# Altium project Biricutico.PrjPCB (part 2 of 2)

## Sheet C_M.SchDoc
size A4
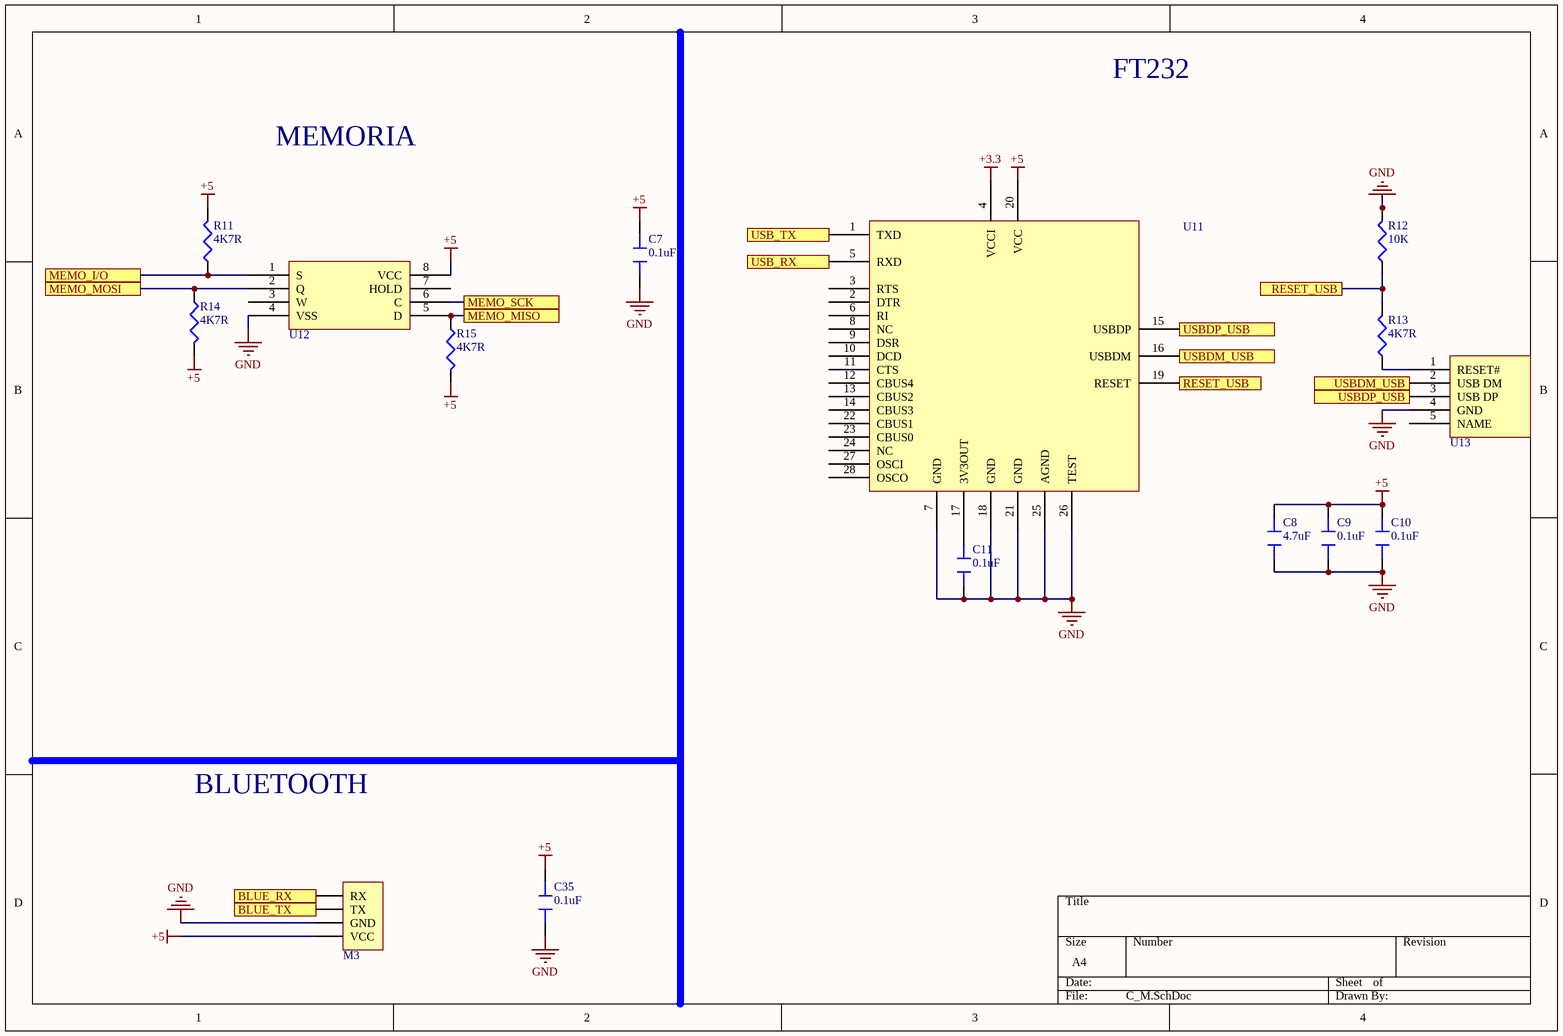
[diagram p5: C_M.SchDoc]

### Parts
C7  0.1uF  [CAPACITOR 0805]
C8  4.7uF  [CAPACITOR 0805]
C9  0.1uF  [CAPACITOR 0805]
C10  0.1uF  [CAPACITOR 0805]
C11  0.1uF  [CAPACITOR 0805]
C35  0.1uF  [CAPACITOR 0805]
M3  Headers (1x4)_BLUE  [HDR1X4]  (value not drawn)
R11  4K7R  [6-0805_M]
R12  10K  [6-0805_M]
R13  4K7R  [6-0805_M]
R14  4K7R  [6-0805_M]
R15  4K7R  [6-0805_M]
U11  USB Interface  [SOP65P780X200-28N]  (value not drawn)
U12  EEPROM 256Kbit  [M95256-DRMN8TP/K]  (value not drawn)
U13  USB Connectors  [USB Micro]  (value not drawn)

### Ports
BLUE_RX, BLUE_TX, MEMO_I/O, MEMO_MISO, MEMO_MOSI, MEMO_SCK, RESET_USB, USB_RX, USB_TX, USBDM_USB, USBDP_USB

### Nets
+3.3: U11.4(VCCI)
+5: C7.2 C8.2 C9.2 C10.2 C35.2 M3.4(VCC) R11.2 R14.2 R15.2 U11.20(VCC) U12.8(VCC)
GND: C7.1 C8.1 C9.1 C10.1 C11.1 C35.1 M3.3(GND) R12.2 U11.7(GND) U11.18(GND) U11.21(GND) U11.25(AGND) U11.26(TEST) U12.4(VSS) U13.4(GND)
BLUE_RX: M3.1(RX) ; port BLUE_RX
BLUE_TX: M3.2(TX) ; port BLUE_TX
MEMO_I/O: R11.1 U12.1(S) ; port MEMO_I/O
MEMO_MISO: R15.1 U12.5(D) ; port MEMO_MISO
MEMO_MOSI: R14.1 U12.2(Q) ; port MEMO_MOSI
MEMO_SCK: U12.6(C) ; port MEMO_SCK
RESET_USB: R12.1 R13.2 U11.19(RESET) ; port RESET_USB
USB_RX: U11.5(RXD) ; port USB_RX
USB_TX: U11.1(TXD) ; port USB_TX
USBDM_USB: U11.16(USBDM) U13.2(USB_DM) ; port USBDM_USB
USBDP_USB: U11.15(USBDP) U13.3(USB_DP) ; port USBDP_USB
NetC11_2: C11.2 U11.17(3V3OUT)
NetR13_1: R13.1 U13.1(RESET#)

Not connected (* = marked no-connect by the designer): U11 2(DTR) 3(RTS) 6(RI) 8(NC) 9(DSR) 10(DCD) 11(CTS) 12(CBUS4) 13(CBUS2) 14(CBUS3) 22(CBUS1) 23(CBUS0) 24(NC) 27(OSCI) 28(OSCO); U12 3(W) 7(HOLD); U13 5(NAME)

### Notes on the sheet
- FT232
- MEMORIA
- BLUETOOTH

### Library data of the parts
C7 C9-C11 C35 = Capacitor  0.1uF 0805: Multilayer Ceramic Capacitors MLCC - SMD/SMT .1uF 50volts 10%; Manufacturer: Vishay Vitramon; Manufacturer Part Number: VJ0805Y104KXAAT; Capacitance: 100nF; Voltage Rating: 50V; Dielectric: X7R; Supplier 1: Mouser; Stock 1: 207342; Pricing 1: 1=0.2, 10=0.2, 50=0.162, 100=0.108, 500=0.095, 1000=0.084, 3000=0.072, 6000=0.069, 9000=0.065, 10000=0.065 (USD); Mount: Surface Mount; Case/Package: 0805; Weight: 0.000194oz; Case Code (Metric): 2012; Case Code (Imperial): 0805; Min Operating Temperature: -55°C; Max Operating Temperature: 125°C; Tolerance: 10%; Package Quantity: 1; Packaging: Tape and Reel; Voltage Rating (DC): 50V; Termination: SMD/SMT; Voltage: 50V; Length: 2mm; Height: 1.45mm; Width: 0.049inch; Thickness: 0.057inch; Depth: 1.25mm; Radiation Hardening: No; REACH SVHC: Unknown; Lead Free: Lead Free; ComponentLink1URL: http://www.mouser.com/ds/2/427/vjcommercialseries-222796.pdf?src-supplier=Mouser; ComponentLink1Description: http://www.mouser.com/ds/2/427/vjcommercialseries-222796.pdf?src-supplier=Mouser; ComponentLink2URL: http://www.vishay.com/docs/45199/vjcommercialseries.pdf?src-supplier=Digi-Key; ComponentLink2Description: http://www.vishay.com/docs/45199/vjcommercialseries.pdf?src-supplier=Digi-Key; ComponentLink3URL: http://www.vishay.com/docs/45199/vjcommercialseries.pdf?src-supplier=Future+Electronics; ComponentLink3Description: http://www.vishay.com/docs/45199/vjcommercialseries.pdf?src-supplier=Future+Electronics; Supplier Part Number 1: 77-VJ0805Y104KXAAT; Category: Multilayer Ceramic Capacitors MLCC - SMD/SMT
C8 = Capacitor 4.7uF 0805: MURATA - GRM21BR61H475KE51L - CAP, 4.7µF, 50V, 10%, X5R, 0805; Material: Ceramic; Supplier 1: Mouser; Manufacturer: Murata; Manufacturer Part Number: GRM21BR61H475KE51L; Stock 1: 243744; Pricing 1: 1=0.37, 10=0.256, 50=0.256, 100=0.153, 500=0.115, 1000=0.097, 3000=0.08, 6000=0.075, 9000=0.071, 10000=0.071 (USD); Mount: Surface Mount; Case/Package: 0805; Case Code (Metric): 2012; Case Code (Imperial): 0805; Min Operating Temperature: -55°C; Max Operating Temperature: 85°C; Capacitance: 4.7uF; Tolerance: 10%; Packaging: Tape and Reel; Dielectric: X5R; Voltage Rating: 50V; Voltage Rating (DC): 50V; Length: 2mm; Height: 1.25mm; Width: 0.049inch; Thickness: 0.055inch; Depth: 1.25mm; REACH SVHC: No SVHC; Lead Free: Lead Free; ComponentLink1URL: http://components.arrow.com/part/dataview/61084395S454511N2606?src-supplier=Arrow; ComponentLink1Description: http://components.arrow.com/part/dataview/61084395S454511N2606?src-supplier=Arrow; ComponentLink2URL: http://components.arrow.com/part/dataview/0323_07281654?src-supplier=Arrow+Europe; ComponentLink2Description: http://components.arrow.com/part/dataview/0323_07281654?src-supplier=Arrow+Europe; ComponentLink3URL: https://search.murata.co.jp/Ceramy/image/img/A01X/G101/ENG/GRM21BR61H475KE51-01.pdf?src-supplier=Digi-Key; ComponentLink3Description: https://search.murata.co.jp/Ceramy/image/img/A01X/G101/ENG/GRM21BR61H475KE51-01.pdf?src-supplier=Digi-Key; ComponentLink4URL: http://search.murata.co.jp/Ceramy/image/img/A01X/G101/ENG/GRM21BR61H475KE51-01.pdf?src-supplier=Digi-Key; ComponentLink4Description: http://search.murata.co.jp/Ceramy/image/img/A01X/G101/ENG/GRM21BR61H475KE51-01.pdf?src-supplier=Digi-Key; ComponentLink5URL: http://www.farnell.com/datasheets/2079186.pdf?src-supplier=Farnell; ComponentLink5Description: http://www.farnell.com/datasheets/2079186.pdf?src-supplier=Farnell; ComponentLink6URL: http://www.farnell.com/datasheets/2079186.pdf?src-supplier=Element14; ComponentLink6Description: http://www.farnell.com/datasheets/2079186.pdf?src-supplier=Element14; ComponentLink7URL: http://www.farnell.com/datasheets/2079186.pdf?src-supplier=Newark; ComponentLink7Description: http://www.farnell.com/datasheets/2079186.pdf?src-supplier=Newark; Supplier Part Number 1: 81-GRM21BR61H475KE1L; Category: Multilayer Ceramic Capacitors MLCC - SMD/SMT
M3 = Headers (1x4)_BLUE: Header, 4-Pin; LatestRevisionDate: 17-Jul-2002; LatestRevisionNote: Re-released for DXP Platform.; Publisher: Altium Limited
R11 R13-R15 = Resistor 4.7K 0805: RES SMD 4.7K OHM 1% 1/8W 0805; Manufacturer: Vishay; Manufacturer Part Number: CRCW08054K70FKEA; Resistance: 4.7kR; Power Rating: 125mW; Voltage Rating: 150V; Temperature Coefficient: 100ppm/°C; Supplier 1: Mouser; Stock 1: 49115; Pricing 1: 1=0.1, 10=0.066, 50=0.066, 100=0.047, 1000=0.027, 10000=0.015 (USD); Case/Package: 0805; Weight: 0.000194oz; Case Code (Imperial): 0805; Case Code (Metric): 2012; Contact Plating: Tin; Min Operating Temperature: -55°C; Max Operating Temperature: 155°C; Tolerance: 1%; Packaging: Tape and Reel; Package Quantity: 10; Composition: Thick Film; Number of Terminations: 2; Termination: SMD/SMT; Military Standard: Not; Max Power Dissipation: 125mW; Voltage Rating (DC): 150V; Features: Automotive AEC-Q200; Length: 2mm; Height: 0.45mm; Width: 1.25mm; Depth: 1.25mm; Radiation Hardening: No; REACH SVHC: Unknown; Lead Free: Lead Free; ComponentLink1URL: http://uk.rs-online.com/webdocs/0d98/0900766b80d98b26.pdf?src-supplier=RSComponents; ComponentLink1Description: http://uk.rs-online.com/webdocs/0d98/0900766b80d98b26.pdf?src-supplier=RSComponents; ComponentLink2URL: http://www.vishay.com/docs/20035/dcrcwe3.pdf?src-supplier=Future+Electronics; ComponentLink2Description: http://www.vishay.com/docs/20035/dcrcwe3.pdf?src-supplier=Future+Electronics; ComponentLink3URL: http://www.alliedelec.com/m/d/0c934d6939ccefa68dbe0b96d821c8cf.pdf?src-supplier=Allied+Electronics; ComponentLink3Description: http://www.alliedelec.com/m/d/0c934d6939ccefa68dbe0b96d821c8cf.pdf?src-supplier=Allied+Electronics; ComponentLink4URL: http://www.mouser.com/ds/2/427/dcrcwe3-109170.pdf?src-supplier=Mouser; ComponentLink4Description: http://www.mouser.com/ds/2/427/dcrcwe3-109170.pdf?src-supplier=Mouser; ComponentLink5URL: https://www.distrelec.biz/Web/Downloads/a_/en/flD-CRCW-e3_data_en.pdf?mime=application%2Fpdf&src-supplier=Distrelec; ComponentLink5Description: https://www.distrelec.biz/Web/Downloads/a_/en/flD-CRCW-e3_data_en.pdf?mime=application%2Fpdf&src-supplier=Distrelec; ComponentLink6URL: http://www.vishay.com/docs/20035/dcrcwe3.pdf?src-supplier=Avnet; ComponentLink6Description: http://www.vishay.com/docs/20035/dcrcwe3.pdf?src-supplier=Avnet; ComponentLink7URL: http://www.vishay.com/docs/20035/dcrcwe3.pdf?src-supplier=Digi-Key; ComponentLink7Description: http://www.vishay.com/docs/20035/dcrcwe3.pdf?src-supplier=Digi-Key; Supplier Part Number 1: 71-CRCW0805-4.7K-E3; Category: Thick Film Resistors - SMD
R12 = Resistor 10k 0805: RES SMD 10K OHM 1% 1/8W 0805; Manufacturer: Vishay; Manufacturer Part Number: CRCW080510K0FKEA; Resistance: 10kR; Power Rating: 125mW; Voltage Rating: 150V; Temperature Coefficient: 100ppm/°C; Supplier 1: Mouser; Stock 1: 474662; Pricing 1: 1=0.1, 10=0.066, 50=0.066, 100=0.06, 1000=0.043, 10000=0.019 (USD); Case/Package: 0805; Weight: 0.000194oz; Case Code (Imperial): 0805; Case Code (Metric): 2012; Contact Plating: Tin; Min Operating Temperature: -55°C; Max Operating Temperature: 155°C; Tolerance: 1%; Packaging: Tape and Reel; Package Quantity: 5000; Composition: Thick Film; Military Standard: Not; Termination: SMD/SMT; Voltage Rating (DC): 150V; Length: 2mm; Height: 0.45mm; Width: 1.25mm; Depth: 1.25mm; Radiation Hardening: No; REACH SVHC: Unknown; Lead Free: Lead Free; ComponentLink1URL: http://www.mouser.com/ds/2/427/dcrcwe3-109170.pdf?src-supplier=Mouser; ComponentLink1Description: http://www.mouser.com/ds/2/427/dcrcwe3-109170.pdf?src-supplier=Mouser; ComponentLink2URL: http://uk.rs-online.com/webdocs/0d98/0900766b80d98b26.pdf?src-supplier=RSComponents; ComponentLink2Description: http://uk.rs-online.com/webdocs/0d98/0900766b80d98b26.pdf?src-supplier=RSComponents; ComponentLink3URL: http://www.alliedelec.com/m/d/0c934d6939ccefa68dbe0b96d821c8cf.pdf?src-supplier=Allied+Electronics; ComponentLink3Description: http://www.alliedelec.com/m/d/0c934d6939ccefa68dbe0b96d821c8cf.pdf?src-supplier=Allied+Electronics; ComponentLink4URL: http://www.vishay.com/docs/20035/dcrcwe3.pdf?src-supplier=Avnet+Asia; ComponentLink4Description: http://www.vishay.com/docs/20035/dcrcwe3.pdf?src-supplier=Avnet+Asia; ComponentLink5URL: http://www.vishay.com/docs/20035/dcrcwe3.pdf?src-supplier=Avnet+Europe; ComponentLink5Description: http://www.vishay.com/docs/20035/dcrcwe3.pdf?src-supplier=Avnet+Europe; ComponentLink6URL: http://www.vishay.com/docs/20035/dcrcwe3.pdf?src-supplier=Avnet; ComponentLink6Description: http://www.vishay.com/docs/20035/dcrcwe3.pdf?src-supplier=Avnet; ComponentLink7URL: http://www.farnell.com/datasheets/2310790.pdf?src-supplier=Element14; ComponentLink7Description: http://www.farnell.com/datasheets/2310790.pdf?src-supplier=Element14; ComponentLink8URL: http://www.vishay.com/docs/20035/dcrcwe3.pdf?src-supplier=Future+Electronics; ComponentLink8Description: http://www.vishay.com/docs/20035/dcrcwe3.pdf?src-supplier=Future+Electronics; Supplier Part Number 1: 71-CRCW0805-10K-E3; Category: Thick Film Resistors - SMD
U11 = USB Interface: IC USB FS SERIAL UART 28-SSOP; Manufacturer: FTDI; Manufacturer Part Number: FT232RL-REEL; Number of Channels: 1; Max Supply Voltage: 5.25V; Min Supply Voltage: 3.3V; Data Rate: 12Mbps; Interface: UART,RS-232,RS-422,RS-485; Operating Supply Current: 15mA; Voltage: 5V; Supplier 1: Mouser; Stock 1: 115709; Pricing 1: 1=4.5, 10=4.05, 50=3.85, 100=3.65, 250=3.25, 500=2.85, 1000=2.65, 6000=2.35, 10000=2.65 (USD); Mount: Surface Mount; Case/Package: SSOP; Number of Pins: 28; Weight: 0.080001oz; Min Operating Temperature: -40°C; Max Operating Temperature: 85°C; Packaging: Tape and Reel; Package Quantity: 2000; Number of Transceivers: 1; Length: 10.2mm; Height: 1.75mm; Width: 5.3mm; Radiation Hardening: No; REACH SVHC: No SVHC; Lead Free: Lead Free; ComponentLink1URL: http://www.jameco.com/Jameco/Products/ProdDS/2161019.pdf?src-supplier=Jameco; ComponentLink1Description: http://www.jameco.com/Jameco/Products/ProdDS/2161019.pdf?src-supplier=Jameco; ComponentLink2URL: http://www.ftdichip.com/Support/Documents/AppNotes/AN_126_User_Guide_For_FT232_Factory%20test%20utility.pdf?src-supplier=Digi-Key; ComponentLink2Description: http://www.ftdichip.com/Support/Documents/AppNotes/AN_126_User_Guide_For_FT232_Factory%20test%20utility.pdf?src-supplier=Digi-Key; ComponentLink3URL: http://www.mouser.com/ds/2/163/DS_FT232R-11534.pdf?src-supplier=Mouser; ComponentLink3Description: http://www.mouser.com/ds/2/163/DS_FT232R-11534.pdf?src-supplier=Mouser; ComponentLink4URL: https://www.verical.com/server-webapp/html/getDatasheet?partID=643207&src-supplier=Verical; ComponentLink4Description: https://www.verical.com/server-webapp/html/getDatasheet?partID=643207&src-supplier=Verical; ComponentLink5URL: http://www.ftdichip.com/Support/Documents/DataSheets/ICs/DS_FT232R.pdf?src-supplier=Future+Electronics; ComponentLink5Description: http://www.ftdichip.com/Support/Documents/DataSheets/ICs/DS_FT232R.pdf?src-supplier=Future+Electronics; ComponentLink6URL: http://datasheet.iiic.cc/ftdi/FT232RL-REEL.pdf?src-supplier=IIIC; ComponentLink6Description: http://datasheet.iiic.cc/ftdi/FT232RL-REEL.pdf?src-supplier=IIIC; Supplier Part Number 1: 895-FT232RL; Category: USB Interface IC
U12 = EEPROM 256Kbit: IC EEPROM 256KBIT 2MHZ 8SOIC; Manufacturer: STMicroelectronics; Interface: SPI,Serial; Supplier 1: Mouser; Manufacturer Part Number: M95256-DRMN8TP/K; Stock 1: 2067; Pricing 1: 1=0.74, 10=0.657, 50=0.657, 100=0.582, 500=0.573, 1000=0.553, 2500=0.461, 5000=0.456, 10000=0.441, 25000=0.395 (USD); Case/Package: SOIC; Number of Pins: 8; Min Operating Temperature: -40°C; Max Operating Temperature: 105°C; Packaging: Tape and Reel; Memory Type: EEPROM; Frequency: 2MHz; ComponentLink1URL: http://www.mouser.com/ds/2/389/DM00159861-542294.pdf?src-supplier=Mouser; ComponentLink1Description: http://www.mouser.com/ds/2/389/DM00159861-542294.pdf?src-supplier=Mouser; ComponentLink2URL: http://www.st.com/st-web-ui/static/active/en/resource/technical/document/datasheet/DM00159861.pdf?src-supplier=Avnet; ComponentLink2Description: http://www.st.com/st-web-ui/static/active/en/resource/technical/document/datasheet/DM00159861.pdf?src-supplier=Avnet; ComponentLink3URL: http://www.st.com/content/ccc/resource/technical/document/datasheet/group3/c8/e0/71/cd/07/cf/48/38/DM00159861/files/DM00159861.pdf/jcr:content/translations/en.DM00159861.pdf?src-supplier=Digi-Key; ComponentLink3Description: http://www.st.com/content/ccc/resource/technical/document/datasheet/group3/c8/e0/71/cd/07/cf/48/38/DM00159861/files/DM00159861.pdf/jcr:content/translations/en.DM00159861.pdf?src-supplier=Digi-Key; Supplier Part Number 1: 511-M95256-DRMN8TP/K; Category: EEPROM
U13 = USB Connectors: MOLEX         67643-0910            USB, 2.0 TYPE A, RECEPTACLE, SMT; Max Voltage Rating (DC): 30V; Gender: Female; Current Rating: 1.5A; Connector Type: USB,Receptacle; Number of Ports: 1; Number of Contacts: 4; USB Standard: USB 2.0; Manufacturer: Molex; Manufacturer Part Number: 67643-0910; Mount: Through Hole; Contact Plating: Gold; Contact Material: Bronze; Number of Terminals: 4; Housing Color: Black; Housing Material: Polyester; Min Operating Temperature: 0°C; Max Operating Temperature: 50°C; Packaging: Tray; Voltage Rating (DC): 30V; Termination: Solder; Voltage Rating: 30V; Orientation: Right Angle; Number of Positions: 4; Number of Circuits: 4; Length: 14.4mm; Depth: 15.26mm; Radiation Hardening: No; REACH SVHC: Unknown; Lead Free: Lead Free; Flammability Rating: UL94 V-0; ComponentLink1URL: http://www.molex.com/webdocs/datasheets/pdf/en-us/0676430910_IO_CONNECTORS.pdf?src-supplier=Avnet+Europe; ComponentLink1Description: http://www.molex.com/webdocs/datasheets/pdf/en-us/0676430910_IO_CONNECTORS.pdf?src-supplier=Avnet+Europe; ComponentLink2URL: http://www.mouser.com/ds/2/276/0676430910_IO_CONNECTORS-172292.pdf?src-supplier=Mouser; ComponentLink2Description: http://www.mouser.com/ds/2/276/0676430910_IO_CONNECTORS-172292.pdf?src-supplier=Mouser; ComponentLink3URL: https://www.verical.com/server-webapp/html/getDatasheet?partID=758674&src-supplier=Verical; ComponentLink3Description: https://www.verical.com/server-webapp/html/getDatasheet?partID=758674&src-supplier=Verical; ComponentLink4URL: http://www.farnell.com/datasheets/1865732.pdf?src-supplier=Element14; ComponentLink4Description: http://www.farnell.com/datasheets/1865732.pdf?src-supplier=Element14; Category: USB Connectors

## Sheet Micro.SchDoc
size A4
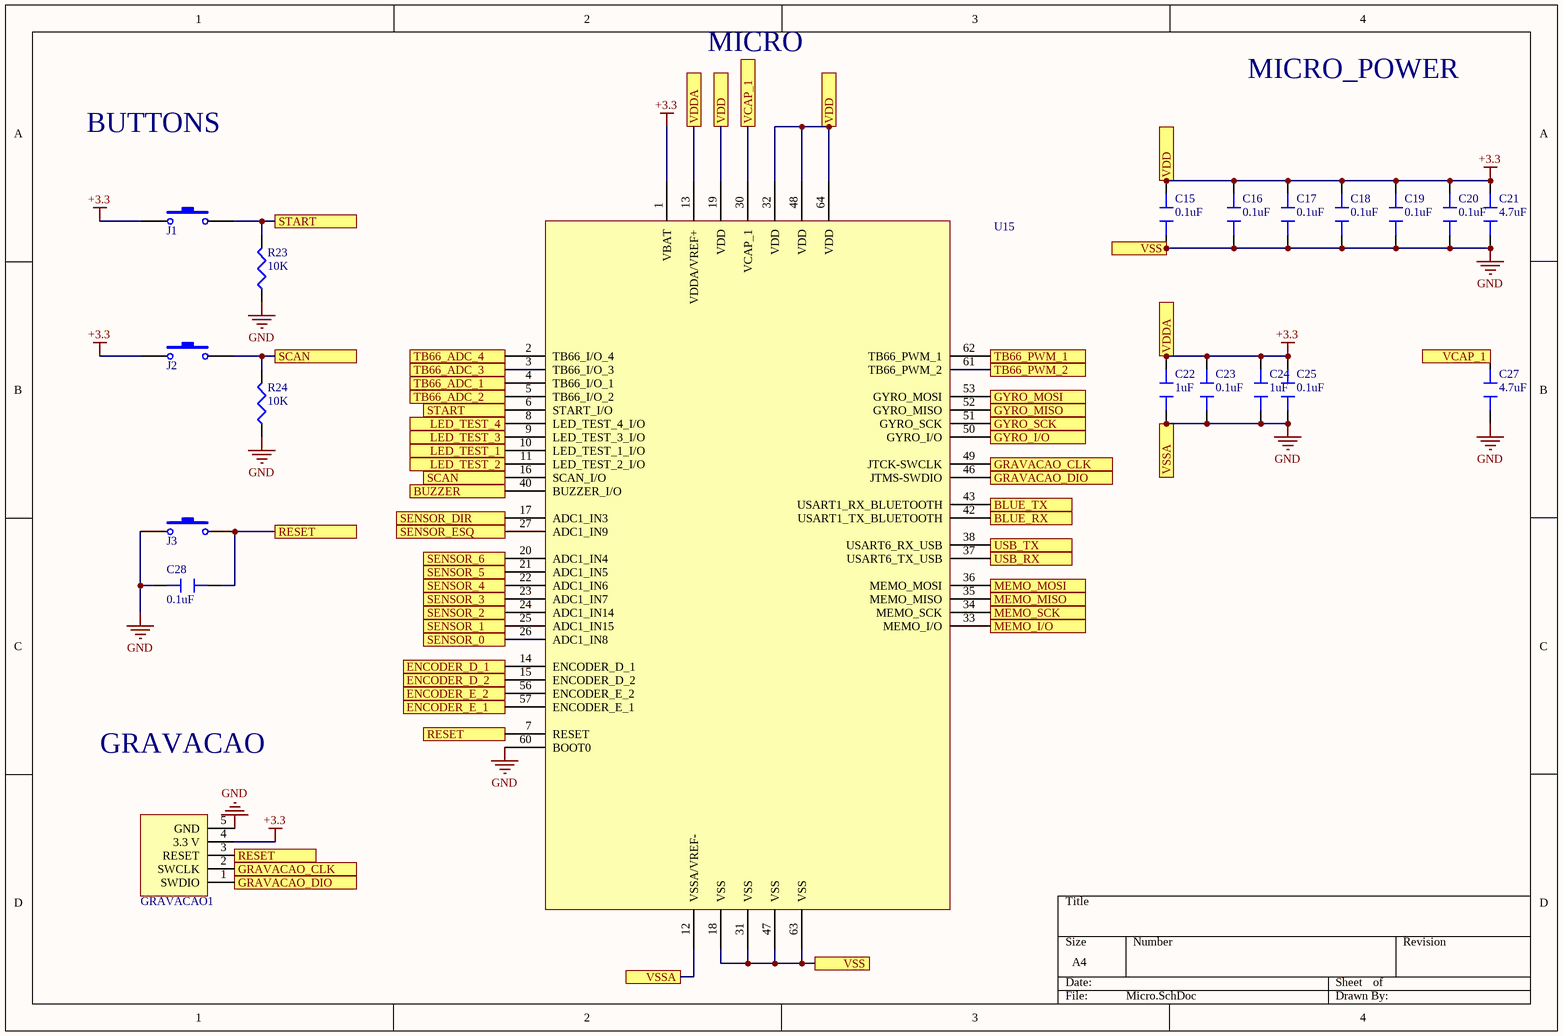
[diagram p6: Micro.SchDoc]

### Parts
C15  0.1uF  [CAPACITOR 0805]
C16  0.1uF  [CAPACITOR 0805]
C17  0.1uF  [CAPACITOR 0805]
C18  0.1uF  [CAPACITOR 0805]
C19  0.1uF  [CAPACITOR 0805]
C20  0.1uF  [CAPACITOR 0805]
C21  4.7uF  [CAPACITOR 0805]
C22  1uF  [CAPACITOR 0805]
C23  0.1uF  [CAPACITOR 0805]
C24  1uF  [CAPACITOR 0805]
C25  0.1uF  [CAPACITOR 0805]
C27  4.7uF  [CAPACITOR 0805]
C28  0.1uF  [CAPACITOR 0805]
GRAVACAO1  Headers (1x5)  [HDR1X5]  (value not drawn)
J1  BUTTON  [FSM4JSMA]  (value not drawn)
J2  BUTTON  [FSM4JSMA]  (value not drawn)
J3  BUTTON  [FSM4JSMA]  (value not drawn)
R23  10K  [6-0805_M]
R24  10K  [6-0805_M]
U15  ARM Microcontrollers  [QFP50P1200X1200X160-64N]  (value not drawn)

### Ports
BLUE_RX, BLUE_TX, BUZZER, ENCODER_D_1, ENCODER_D_2, ENCODER_E_1, ENCODER_E_2, GRAVACAO_CLK, GRAVACAO_DIO, GYRO_I/O, GYRO_MISO, GYRO_MOSI, GYRO_SCK, LED_TEST_1, LED_TEST_2, LED_TEST_3, LED_TEST_4, MEMO_I/O, MEMO_MISO, MEMO_MOSI, MEMO_SCK, RESET, SCAN, SENSOR_0, SENSOR_1, SENSOR_2, SENSOR_3, SENSOR_4, SENSOR_5, SENSOR_6, SENSOR_DIR, SENSOR_ESQ, START, TB66_ADC_1, TB66_ADC_2, TB66_ADC_3, TB66_ADC_4, TB66_PWM_1, TB66_PWM_2, USB_RX, USB_TX, VCAP_1, VDD, VDDA, VSS, VSSA

### Nets
+3.3: C15.2 C16.2 C17.2 C18.2 C19.2 C20.2 C21.2 C22.2 C23.2 C24.2 C25.2 GRAVACAO1.4(3.3_V) J1.1 J2.1 U15.1(VBAT) U15.13(VDDA/VREF+) U15.19(VDD) U15.32(VDD) U15.48(VDD) U15.64(VDD) ; port VDD, port VDDA
GND: C15.1 C16.1 C17.1 C18.1 C19.1 C20.1 C21.1 C22.1 C23.1 C24.1 C25.1 C27.1 C28.1 GRAVACAO1.5(GND) J3.1 R23.1 R24.1 U15.12(VSSA/VREF-) U15.18(VSS) U15.31(VSS) U15.47(VSS) U15.60(BOOT0) U15.63(VSS) ; port VSS, port VSSA
BLUE_RX: U15.42(USART1_TX_BLUETOOTH) ; port BLUE_RX
BLUE_TX: U15.43(USART1_RX_BLUETOOTH) ; port BLUE_TX
BUZZER: U15.40(BUZZER_I/O) ; port BUZZER
ENCODER_D_1: U15.14(ENCODER_D_1) ; port ENCODER_D_1
ENCODER_D_2: U15.15(ENCODER_D_2) ; port ENCODER_D_2
ENCODER_E_1: U15.57(ENCODER_E_1) ; port ENCODER_E_1
ENCODER_E_2: U15.56(ENCODER_E_2) ; port ENCODER_E_2
GRAVACAO_CLK: GRAVACAO1.2(SWCLK) U15.49(JTCK-SWCLK) ; port GRAVACAO_CLK
GRAVACAO_DIO: GRAVACAO1.1(SWDIO) U15.46(JTMS-SWDIO) ; port GRAVACAO_DIO
GYRO_I/O: U15.50(GYRO_I/O) ; port GYRO_I/O
GYRO_MISO: U15.52(GYRO_MISO) ; port GYRO_MISO
GYRO_MOSI: U15.53(GYRO_MOSI) ; port GYRO_MOSI
GYRO_SCK: U15.51(GYRO_SCK) ; port GYRO_SCK
LED_TEST_1: U15.10(LED_TEST_1_I/O) ; port LED_TEST_1
LED_TEST_2: U15.11(LED_TEST_2_I/O) ; port LED_TEST_2
LED_TEST_3: U15.9(LED_TEST_3_I/O) ; port LED_TEST_3
LED_TEST_4: U15.8(LED_TEST_4_I/O) ; port LED_TEST_4
MEMO_I/O: U15.33(MEMO_I/O) ; port MEMO_I/O
MEMO_MISO: U15.35(MEMO_MISO) ; port MEMO_MISO
MEMO_MOSI: U15.36(MEMO_MOSI) ; port MEMO_MOSI
MEMO_SCK: U15.34(MEMO_SCK) ; port MEMO_SCK
RESET: C28.2 GRAVACAO1.3(RESET) J3.2 U15.7(RESET) ; port RESET
SCAN: J2.2 R24.2 U15.16(SCAN_I/O) ; port SCAN
SENSOR_0: U15.26(ADC1_IN8) ; port SENSOR_0
SENSOR_1: U15.25(ADC1_IN15) ; port SENSOR_1
SENSOR_2: U15.24(ADC1_IN14) ; port SENSOR_2
SENSOR_3: U15.23(ADC1_IN7) ; port SENSOR_3
SENSOR_4: U15.22(ADC1_IN6) ; port SENSOR_4
SENSOR_5: U15.21(ADC1_IN5) ; port SENSOR_5
SENSOR_6: U15.20(ADC1_IN4) ; port SENSOR_6
SENSOR_DIR: U15.17(ADC1_IN3) ; port SENSOR_DIR
SENSOR_ESQ: U15.27(ADC1_IN9) ; port SENSOR_ESQ
START: J1.2 R23.2 U15.6(START_I/O) ; port START
TB66_ADC_1: U15.4(TB66_I/O_1) ; port TB66_ADC_1
TB66_ADC_2: U15.5(TB66_I/O_2) ; port TB66_ADC_2
TB66_ADC_3: U15.3(TB66_I/O_3) ; port TB66_ADC_3
TB66_ADC_4: U15.2(TB66_I/O_4) ; port TB66_ADC_4
TB66_PWM_1: U15.62(TB66_PWM_1) ; port TB66_PWM_1
TB66_PWM_2: U15.61(TB66_PWM_2) ; port TB66_PWM_2
USB_RX: U15.37(USART6_TX_USB) ; port USB_RX
USB_TX: U15.38(USART6_RX_USB) ; port USB_TX
VCAP_1: C27.2 U15.30(VCAP_1) ; port VCAP_1

### Notes on the sheet
- MICRO
- MICRO_POWER
- BUTTONS
- GRAVACAO

### Library data of the parts
C15-C20 C23 C25 C28 = Capacitor  0.1uF 0805: as C7 on sheet C_M; Supplier 1: Mouser; Stock 1: 207342; Pricing 1: 1=0.2, 10=0.2, 50=0.162, 100=0.108, 500=0.095, 1000=0.084, 3000=0.072, 6000=0.069, 9000=0.065, 10000=0.065 (USD); Mount: Surface Mount; Case/Package: 0805; Weight: 0.000194oz; Case Code (Metric): 2012; Case Code (Imperial): 0805; Min Operating Temperature: -55°C; Max Operating Temperature: 125°C; Tolerance: 10%; Package Quantity: 1; Packaging: Tape and Reel; Voltage Rating (DC): 50V; Termination: SMD/SMT; Voltage: 50V; Length: 2mm; Height: 1.45mm; Width: 0.049inch; Thickness: 0.057inch; Depth: 1.25mm; Radiation Hardening: No; REACH SVHC: Unknown; Lead Free: Lead Free; ComponentLink1URL: http://www.mouser.com/ds/2/427/vjcommercialseries-222796.pdf?src-supplier=Mouser; ComponentLink1Description: http://www.mouser.com/ds/2/427/vjcommercialseries-222796.pdf?src-supplier=Mouser; ComponentLink2URL: http://www.vishay.com/docs/45199/vjcommercialseries.pdf?src-supplier=Digi-Key; ComponentLink2Description: http://www.vishay.com/docs/45199/vjcommercialseries.pdf?src-supplier=Digi-Key; ComponentLink3URL: http://www.vishay.com/docs/45199/vjcommercialseries.pdf?src-supplier=Future+Electronics; ComponentLink3Description: http://www.vishay.com/docs/45199/vjcommercialseries.pdf?src-supplier=Future+Electronics; Supplier Part Number 1: 77-VJ0805Y104KXAAT; Category: Multilayer Ceramic Capacitors MLCC - SMD/SMT
C21 C27 = Capacitor 4.7uF 0805: as C8 on sheet C_M; Supplier 1: Mouser; Manufacturer: Murata; Manufacturer Part Number: GRM21BR61H475KE51L; Stock 1: 243744; Pricing 1: 1=0.37, 10=0.256, 50=0.256, 100=0.153, 500=0.115, 1000=0.097, 3000=0.08, 6000=0.075, 9000=0.071, 10000=0.071 (USD); Mount: Surface Mount; Case/Package: 0805; Case Code (Metric): 2012; Case Code (Imperial): 0805; Min Operating Temperature: -55°C; Max Operating Temperature: 85°C; Capacitance: 4.7uF; Tolerance: 10%; Packaging: Tape and Reel; Dielectric: X5R; Voltage Rating: 50V; Voltage Rating (DC): 50V; Length: 2mm; Height: 1.25mm; Width: 0.049inch; Thickness: 0.055inch; Depth: 1.25mm; REACH SVHC: No SVHC; Lead Free: Lead Free; ComponentLink1URL: http://components.arrow.com/part/dataview/61084395S454511N2606?src-supplier=Arrow; ComponentLink1Description: http://components.arrow.com/part/dataview/61084395S454511N2606?src-supplier=Arrow; ComponentLink2URL: http://components.arrow.com/part/dataview/0323_07281654?src-supplier=Arrow+Europe; ComponentLink2Description: http://components.arrow.com/part/dataview/0323_07281654?src-supplier=Arrow+Europe; ComponentLink3URL: https://search.murata.co.jp/Ceramy/image/img/A01X/G101/ENG/GRM21BR61H475KE51-01.pdf?src-supplier=Digi-Key; ComponentLink3Description: https://search.murata.co.jp/Ceramy/image/img/A01X/G101/ENG/GRM21BR61H475KE51-01.pdf?src-supplier=Digi-Key; ComponentLink4URL: http://search.murata.co.jp/Ceramy/image/img/A01X/G101/ENG/GRM21BR61H475KE51-01.pdf?src-supplier=Digi-Key; ComponentLink4Description: http://search.murata.co.jp/Ceramy/image/img/A01X/G101/ENG/GRM21BR61H475KE51-01.pdf?src-supplier=Digi-Key; ComponentLink5URL: http://www.farnell.com/datasheets/2079186.pdf?src-supplier=Farnell; ComponentLink5Description: http://www.farnell.com/datasheets/2079186.pdf?src-supplier=Farnell; ComponentLink6URL: http://www.farnell.com/datasheets/2079186.pdf?src-supplier=Element14; ComponentLink6Description: http://www.farnell.com/datasheets/2079186.pdf?src-supplier=Element14; ComponentLink7URL: http://www.farnell.com/datasheets/2079186.pdf?src-supplier=Newark; ComponentLink7Description: http://www.farnell.com/datasheets/2079186.pdf?src-supplier=Newark; Supplier Part Number 1: 81-GRM21BR61H475KE1L; Category: Multilayer Ceramic Capacitors MLCC - SMD/SMT
C22 C24 = Capacitor 1uF 0805: Cap Ceramic 1uF 25V X7R 10% SMD 0805 125C Blister T/R; Manufacturer: Vishay; Manufacturer Part Number: VJ0805Y105KXXTW1BC; Dielectric Material: Tantalum; Supplier 1: Mouser; Stock 1: 40011; Pricing 1: 1=0.11, 10=0.11, 50=0.11, 100=0.055, 1000=0.038, 10000=0.038 (USD); Mount: Surface Mount; Case/Package: 0805; Min Operating Temperature: -55°C; Max Operating Temperature: 125°C; Capacitance: 1uF; Tolerance: 10%; Dielectric: X7R; Termination: Wraparound; Packaging: Tape and Reel; Voltage Rating (DC): 25V; Length: 2mm; Height: 1.25mm; Depth: 1.25mm; Radiation Hardening: No; Lead Free: Lead Free; ComponentLink1URL: http://www.vishay.com/docs/28548/vjw1bcbascomseries.pdf?src-supplier=Avnet+Europe; ComponentLink1Description: http://www.vishay.com/docs/28548/vjw1bcbascomseries.pdf?src-supplier=Avnet+Europe; Supplier Part Number 1: 77-VJ805Y105KXXTW1BC; Category: Multilayer Ceramic Capacitors MLCC - SMD/SMT
GRAVACAO1 = Headers (1x5): Conn Unshrouded Header HDR 5 POS 2.54mm Solder ST Thru-Hole Bag; Manufacturer: Molex; Manufacturer Part Number: 0022284053; Contact Resistance: 20mR; Number of Positions: 5; Max Voltage Rating (AC): 250V; Gender: Male; Connector Type: Male Pin; Supplier 1: Mouser; Stock 1: 10577; Pricing 1: 1=0.4, 10=0.373, 25=0.335, 50=0.298, 100=0.286, 250=0.261, 500=0.248, 1000=0.205, 2500=0.186, 10000=0.186 (USD); Mount: Through Hole; Color: Black; Contact Plating: Gold; Contact Material: Bronze; Housing Color: Black; Housing Material: Nylon; Min Operating Temperature: 0°C; Max Operating Temperature: 75°C; Package Quantity: 1; Packaging: Bulk; Number of Rows: 1; Termination: Solder; Number of Contacts: 5; Max Voltage Rating (DC): 250V; Orientation: Straight; Length: 12.7mm; Pitch: 2.54mm; Contact Mating Length: 0.24inch; Depth: 2.49mm; ComponentLink1URL: http://www.molex.com/webdocs/datasheets/pdf/en-us/0022284053_PCB_HEADERS.pdf?src-supplier=Avnet; ComponentLink1Description: http://www.molex.com/webdocs/datasheets/pdf/en-us/0022284053_PCB_HEADERS.pdf?src-supplier=Avnet; ComponentLink2URL: http://www.molex.com/pdm_docs/sd/022284053_sd.pdf?src-supplier=Digi-Key; ComponentLink2Description: http://www.molex.com/pdm_docs/sd/022284053_sd.pdf?src-supplier=Digi-Key; Supplier Part Number 1: 538-22-28-4053; Category: Headers & Wire Housings
J1-J3 = Switch: Manufacturer: Panasonic; Manufacturer Part Number: EVP-BFAC1A000; Mechanical Life: 1000000Cycles; Throw Configuration: SPST; Illumination Type: Non-Illuminated; Switch Function: Off-Mom; Operating Force: 200gf; Switch Travel: 0.25mm; Supplier 1: Mouser; Stock 1: 3866; Pricing 1: 1=0.3, 10=0.265, 100=0.203, 1000=0.173, 2000=0.134, 9000=0.134 (USD); Mount: Surface Mount; Min Operating Temperature: -40°C; Max Operating Temperature: 85°C; Packaging: Tape and Reel; ComponentLink1URL: https://industrial.panasonic.com/ac/cdn/e/control/switch/light-touch/catalog/sw_lt_eng_6s_mid.pdf?src-supplier=Digi-Key; ComponentLink1Description: https://industrial.panasonic.com/ac/cdn/e/control/switch/light-touch/catalog/sw_lt_eng_6s_mid.pdf?src-supplier=Digi-Key; Category: Tactile Switches; Supplier Part Number 1: 667-EVP-BFAC1A000
R23 R24 = Resistor 10k 0805: as R12 on sheet C_M; Supplier 1: Mouser; Stock 1: 474662; Pricing 1: 1=0.1, 10=0.066, 50=0.066, 100=0.06, 1000=0.043, 10000=0.019 (USD); Case/Package: 0805; Weight: 0.000194oz; Case Code (Imperial): 0805; Case Code (Metric): 2012; Contact Plating: Tin; Min Operating Temperature: -55°C; Max Operating Temperature: 155°C; Tolerance: 1%; Packaging: Tape and Reel; Package Quantity: 5000; Composition: Thick Film; Military Standard: Not; Termination: SMD/SMT; Voltage Rating (DC): 150V; Length: 2mm; Height: 0.45mm; Width: 1.25mm; Depth: 1.25mm; Radiation Hardening: No; REACH SVHC: Unknown; Lead Free: Lead Free; ComponentLink1URL: http://www.mouser.com/ds/2/427/dcrcwe3-109170.pdf?src-supplier=Mouser; ComponentLink1Description: http://www.mouser.com/ds/2/427/dcrcwe3-109170.pdf?src-supplier=Mouser; ComponentLink2URL: http://uk.rs-online.com/webdocs/0d98/0900766b80d98b26.pdf?src-supplier=RSComponents; ComponentLink2Description: http://uk.rs-online.com/webdocs/0d98/0900766b80d98b26.pdf?src-supplier=RSComponents; ComponentLink3URL: http://www.alliedelec.com/m/d/0c934d6939ccefa68dbe0b96d821c8cf.pdf?src-supplier=Allied+Electronics; ComponentLink3Description: http://www.alliedelec.com/m/d/0c934d6939ccefa68dbe0b96d821c8cf.pdf?src-supplier=Allied+Electronics; ComponentLink4URL: http://www.vishay.com/docs/20035/dcrcwe3.pdf?src-supplier=Avnet+Asia; ComponentLink4Description: http://www.vishay.com/docs/20035/dcrcwe3.pdf?src-supplier=Avnet+Asia; ComponentLink5URL: http://www.vishay.com/docs/20035/dcrcwe3.pdf?src-supplier=Avnet+Europe; ComponentLink5Description: http://www.vishay.com/docs/20035/dcrcwe3.pdf?src-supplier=Avnet+Europe; ComponentLink6URL: http://www.vishay.com/docs/20035/dcrcwe3.pdf?src-supplier=Avnet; ComponentLink6Description: http://www.vishay.com/docs/20035/dcrcwe3.pdf?src-supplier=Avnet; ComponentLink7URL: http://www.farnell.com/datasheets/2310790.pdf?src-supplier=Element14; ComponentLink7Description: http://www.farnell.com/datasheets/2310790.pdf?src-supplier=Element14; ComponentLink8URL: http://www.vishay.com/docs/20035/dcrcwe3.pdf?src-supplier=Future+Electronics; ComponentLink8Description: http://www.vishay.com/docs/20035/dcrcwe3.pdf?src-supplier=Future+Electronics; Supplier Part Number 1: 71-CRCW0805-10K-E3; Category: Thick Film Resistors - SMD
U15 = ARM Microcontrollers: MCU 32-bit STM32 ARM Cortex M4 RISC 128KB Flash 1.8V/2.5V/3.3V 64-Pin LQFP Tray; Manufacturer: STMicroelectronics; Manufacturer Part Number: STM32F401RBT6; RAM Size: 64KB; Max Power Dissipation: 313mW; Interface: I2C,SPI,I2S,USART,USB,IrDA,SDIO,UART,LIN; Number of I/Os: 50; Number of Timers/Counters: 8; Frequency: 84MHz; Max Supply Voltage: 3.6V; Min Supply Voltage: 1.8V; Oscillator Type: Internal; Data Bus Width: 32b; Watchdog Timer: Yes; Peripherals: Brown-out Detect/Reset,POR,PWM,WDT,DMA; Number of USB Channels: 1; Number of SPI Channels: 7; Operating Supply Voltage: 3.3V; Number of I2C Channels: 3; Number of PWM Channels: 4; Supplier 1: Mouser; Stock 1: 918; Pricing 1: 1=4.58, 10=4, 50=4, 100=3.37, 250=2.9, 500=2.81, 1000=2.42, 10000=2.42 (USD); Case/Package: LQFP; Number of Pins: 64; Weight: 0.012088oz; Min Operating Temperature: -40°C; Max Operating Temperature: 85°C; Memory Type: FLASH; Packaging: Tray; Number of Programmable I/O: 50; Max Frequency: 84MHz; Memory Size: 128KB; Core Architecture: ARM; Package Quantity: 960; Number of ADC Channels: 1; Length: 10mm; Height: 1.45mm; Width: 10mm; Radiation Hardening: No; REACH SVHC: No SVHC; Lead Free: Lead Free; Supplier Part Number 1: 511-STM32F401RBT6; Category: ARM Microcontrollers - MCU

## Sheet Side.SchDoc
size A4
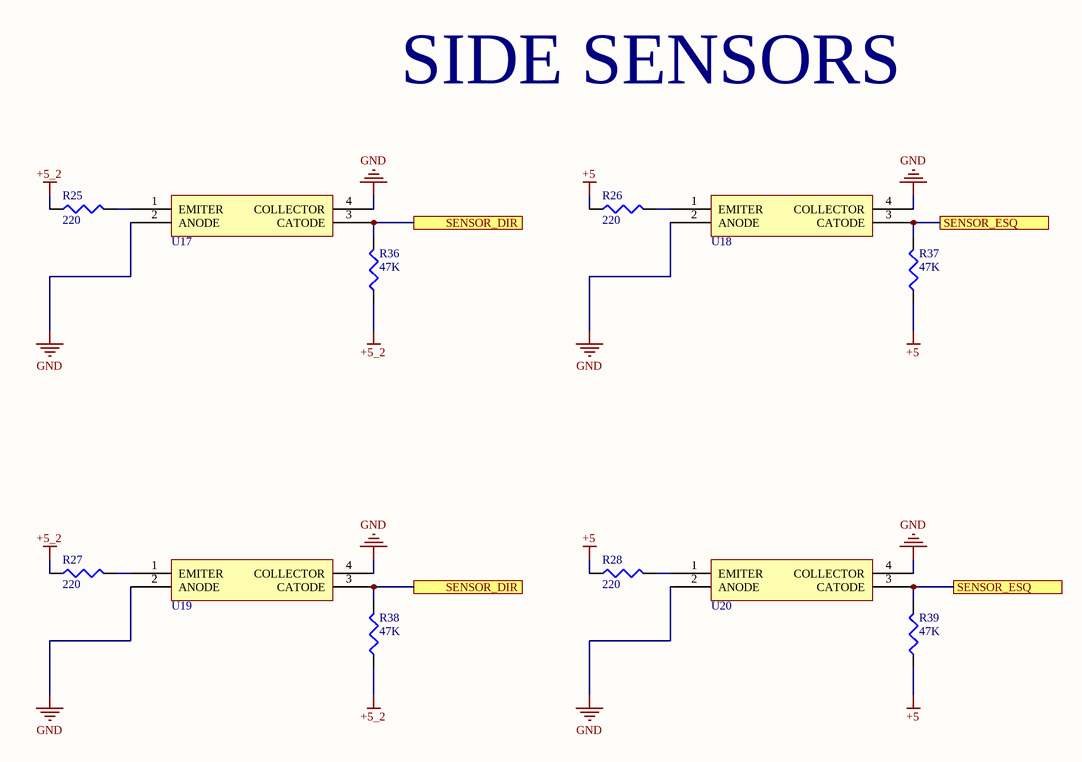
[diagram p7: Side.SchDoc]

### Parts
R25  220  [6-0805_M]
R26  220  [6-0805_M]
R27  220  [6-0805_M]
R28  220  [6-0805_M]
R36  47K  [6-0805_M]
R37  47K  [6-0805_M]
R38  47K  [6-0805_M]
R39  47K  [6-0805_M]
U17  Optical Switches  [QRE1113GR]  (value not drawn)
U18  Optical Switches  [QRE1113GR]  (value not drawn)
U19  Optical Switches  [QRE1113GR]  (value not drawn)
U20  Optical Switches  [QRE1113GR]  (value not drawn)

### Ports
SENSOR_DIR, SENSOR_ESQ

### Nets
+5: R26.1 R28.1 R37.1 R39.1
+5_2: R25.1 R27.1 R36.1 R38.1
GND: U17.2(ANODE) U17.4(COLLECTOR) U18.2(ANODE) U18.4(COLLECTOR) U19.2(ANODE) U19.4(COLLECTOR) U20.2(ANODE) U20.4(COLLECTOR)
SENSOR_DIR: R36.2 R38.2 U17.3(CATODE) U19.3(CATODE) ; port SENSOR_DIR
SENSOR_ESQ: R37.2 R39.2 U18.3(CATODE) U20.3(CATODE) ; port SENSOR_ESQ
NetR25_2: R25.2 U17.1(EMITER)
NetR26_2: R26.2 U18.1(EMITER)
NetR27_2: R27.2 U19.1(EMITER)
NetR28_2: R28.2 U20.1(EMITER)

### Notes on the sheet
- SIDE SENSORS

### Library data of the parts
R25-R28 = Resistor 220 0805: RES SMD 220 OHM 1% 1/8W 0805; Manufacturer: Vishay Semiconductors; Manufacturer Part Number: CRCW0805220RFKEAC; Resistance: 220R; Power Rating: 125mW; Temperature Coefficient: 100ppm/°C; Supplier 1: Mouser; Stock 1: 36802; Pricing 1: 1=0.1, 10=0.052, 100=0.02, 500=0.012, 1000=0.006, 5000=0.005 (USD); Mount: Surface Mount; Case/Package: SMD/SMT; Contact Plating: Tin; Min Operating Temperature: -55°C; Max Operating Temperature: 155°C; Composition: Thick Film; Tolerance: 1%; Termination: Wraparound; Length: 2mm; Lead Free: Lead Free; Supplier Part Number 1: 71-CRCW0805220RFKEAC; Category: Thick Film Resistors - SMD
R36-R39 = Resistor 47K 0805: RES SMD 47K OHM 1% 1/8W 0805; Manufacturer: Vishay; Manufacturer Part Number: CRCW080547K0FKEA; Resistance: 47kR; Voltage Rating: 150V; Power Rating: 125mW; Temperature Coefficient: 100ppm/°C; Supplier 1: Mouser; Stock 1: 21962; Pricing 1: 1=0.1, 10=0.066, 50=0.066, 100=0.047, 1000=0.027, 5000=0.019, 10000=0.015, 25000=0.013, 50000=0.011, 100000=0.01 (USD); Case/Package: 0805; Weight: 0.000194oz; Case Code (Imperial): 0805; Case Code (Metric): 2012; Contact Plating: Tin; Min Operating Temperature: -55°C; Max Operating Temperature: 155°C; Tolerance: 1%; Packaging: Tape and Reel; Package Quantity: 10; Composition: Thick Film; Termination: SMD/SMT; Number of Terminations: 2; Military Standard: Not; Max Power Dissipation: 125mW; Voltage Rating (DC): 150V; Features: Automotive AEC-Q200; Working Voltage: 150V; Length: 2mm; Height: 0.45mm; Width: 1.25mm; Depth: 1.25mm; Radiation Hardening: No; REACH SVHC: Unknown; Lead Free: Lead Free; ComponentLink1URL: https://www.alliedelec.com/m/d/0c934d6939ccefa68dbe0b96d821c8cf.pdf?src-supplier=Allied+Electronics; ComponentLink1Description: https://www.alliedelec.com/m/d/0c934d6939ccefa68dbe0b96d821c8cf.pdf?src-supplier=Allied+Electronics; ComponentLink2URL: http://www.vishay.com/docs/20035/dcrcwe3.pdf?src-supplier=Digi-Key; ComponentLink2Description: http://www.vishay.com/docs/20035/dcrcwe3.pdf?src-supplier=Digi-Key; ComponentLink3URL: http://www.vishay.com/docs/20035/dcrcwe3.pdf?src-supplier=Future+Electronics; ComponentLink3Description: http://www.vishay.com/docs/20035/dcrcwe3.pdf?src-supplier=Future+Electronics; ComponentLink4URL: https://www.distrelec.biz/Web/Downloads/a_/en/flD-CRCW-e3_data_en.pdf?mime=application%2Fpdf&src-supplier=Distrelec; ComponentLink4Description: https://www.distrelec.biz/Web/Downloads/a_/en/flD-CRCW-e3_data_en.pdf?mime=application%2Fpdf&src-supplier=Distrelec; ComponentLink5URL: http://www.farnell.com/datasheets/2310790.pdf?src-supplier=Element14; ComponentLink5Description: http://www.farnell.com/datasheets/2310790.pdf?src-supplier=Element14; ComponentLink6URL: http://www.vishay.com/docs/20035/dcrcwe3.pdf?src-supplier=Avnet; ComponentLink6Description: http://www.vishay.com/docs/20035/dcrcwe3.pdf?src-supplier=Avnet; ComponentLink7URL: http://uk.rs-online.com/webdocs/0d98/0900766b80d98b26.pdf?src-supplier=RSComponents; ComponentLink7Description: http://uk.rs-online.com/webdocs/0d98/0900766b80d98b26.pdf?src-supplier=RSComponents; ComponentLink8URL: http://www.vishay.com/docs/20035/dcrcwe3.pdf?src-supplier=Avnet+Europe; ComponentLink8Description: http://www.vishay.com/docs/20035/dcrcwe3.pdf?src-supplier=Avnet+Europe; ComponentLink9URL: http://www.farnell.com/datasheets/2046716.pdf?src-supplier=Element14; ComponentLink9Description: http://www.farnell.com/datasheets/2046716.pdf?src-supplier=Element14; Supplier Part Number 1: 71-CRCW0805-47K-E3; Category: Thick Film Resistors - SMD
U17-U20 = Optical Switches: SENSOR OPTO TRANS REFL SMD PHOTO; Manufacturer: ON Semiconductor / Fairchild; Wavelength: 940nm; Forward Current: 50mA; Rise Time: 20us; Forward Voltage: 1.2V; Sensing Distance: 0.197inch; Collector Emitter Voltage (VCEO): 30V; Max Collector Current: 20mA; Number of Channels: 1; Reverse Breakdown Voltage: 5V; Power Dissipation: 75mW; Operating Supply Voltage: 1.7V; Output Type: Phototransistor; Supplier 1: Mouser; Manufacturer Part Number: QRE1113GR; Stock 1: 10425; Pricing 1: 1=0.86, 10=0.713, 50=0.713, 100=0.46, 1000=0.368, 10000=0.3 (USD); Mount: Surface Mount; Case/Package: SMD/SMT; Number of Pins: 4; Weight: 0.078g; Contact Plating: Tin,Matte; Min Operating Temperature: -40°C; Max Operating Temperature: 85°C; Packaging: Tape and Reel; Fall Time: 20us; Package Quantity: 1000; Reverse Voltage (DC): 5V; Collector Emitter Breakdown Voltage: 30V; Response Time: 20us; Max Breakdown Voltage: 30V; Number of Elements: 1; Input Current: 50mA; Max Power Dissipation: 75mW; Length: 3.6mm; Height: 1.7mm; Width: 2.9mm; Radiation Hardening: No; REACH SVHC: No SVHC; Lead Free: Lead Free; ComponentLink1URL: http://www.farnell.com/datasheets/1725706.pdf?src-supplier=Element14; ComponentLink1Description: http://www.farnell.com/datasheets/1725706.pdf?src-supplier=Element14; ComponentLink2URL: https://www.verical.com/server-webapp/html/getDatasheet?partID=146181&src-supplier=Verical; ComponentLink2Description: https://www.verical.com/server-webapp/html/getDatasheet?partID=146181&src-supplier=Verical; ComponentLink3URL: https://www.fairchildsemi.com/datasheets/QR/QRE1113.pdf?src-supplier=Avnet; ComponentLink3Description: https://www.fairchildsemi.com/datasheets/QR/QRE1113.pdf?src-supplier=Avnet; ComponentLink4URL: http://www.fairchildsemi.com/ds/QR/QRE1113.pdf?src-supplier=Avnet+Europe; ComponentLink4Description: http://www.fairchildsemi.com/ds/QR/QRE1113.pdf?src-supplier=Avnet+Europe; ComponentLink5URL: https://www.fairchildsemi.com/datasheets/QR/QRE1113.pdf?src-supplier=Digi-Key; ComponentLink5Description: https://www.fairchildsemi.com/datasheets/QR/QRE1113.pdf?src-supplier=Digi-Key; Supplier Part Number 1: 512-QRE1113GR; Category: Optical Switches, Reflective, Phototransistor Output

## Sheet Leds.SchDoc
size A4
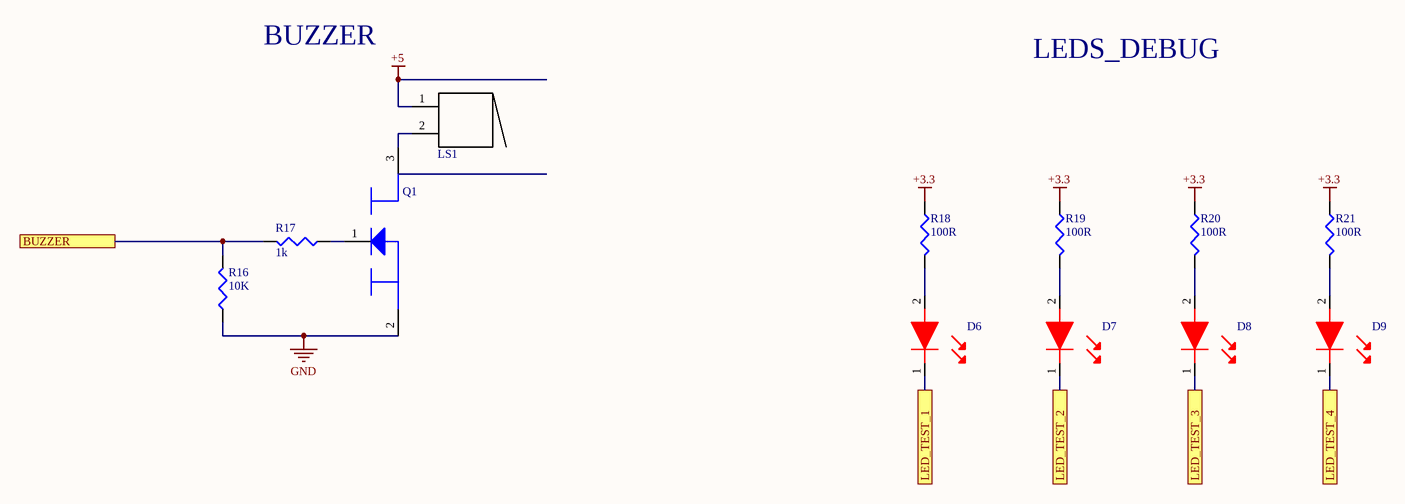
[diagram p8: Leds.SchDoc]

### Parts
D6  Standard LEDs - SMD  [Standard LEDs - SMD]  (value not drawn)
D7  Standard LEDs - SMD  [Standard LEDs - SMD]  (value not drawn)
D8  Standard LEDs - SMD  [Standard LEDs - SMD]  (value not drawn)
D9  Standard LEDs - SMD  [Standard LEDs - SMD]  (value not drawn)
LS1  Buzzers  [Buzzer]  (value not drawn)
Q1  MOSFET  [SOT96P240X110-3N]  (value not drawn)
R16  10K  [6-0805_M]
R17  1k  [6-0805_M]
R18  100R  [0603]
R19  100R  [0603]
R20  100R  [0603]
R21  100R  [0603]

### Ports
BUZZER, LED_TEST_1, LED_TEST_2, LED_TEST_3, LED_TEST_4

### Nets
+3.3: R18.1 R19.1 R20.1 R21.1
+5: LS1.1
GND: Q1.2 R16.1
BUZZER: R16.2 R17.2 ; port BUZZER
LED_TEST_1: D6.1 ; port LED_TEST_1
LED_TEST_2: D7.1 ; port LED_TEST_2
LED_TEST_3: D8.1 ; port LED_TEST_3
LED_TEST_4: D9.1 ; port LED_TEST_4
NetD6_2: D6.2 R18.2
NetD7_2: D7.2 R19.2
NetD8_2: D8.2 R20.2
NetD9_2: D9.2 R21.2
NetLS1_2: LS1.2 Q1.3
NetQ1_1: Q1.1 R17.1

### Notes on the sheet
- BUZZER
- LEDS_DEBUG

### Library data of the parts
D6-D9 = Standard LEDs - SMD: WURTH ELEKTRONIK - 150060RS75000 - LED, 0603, RED, 250MCD, 625NM; Manufacturer: Wurth Electronics; Viewing Angle: 140°; Lens Style: Clear,Rectangular; Forward Current: 30mA; Forward Voltage: 2V; Test Current: 20mA; Supplier 1: Mouser; Manufacturer Part Number: 150060RS75000; Stock 1: 77279; Pricing 1: 1=0.14, 10=0.138, 50=0.129, 100=0.11, 1000=0.095, 10000=0.095 (USD); Mount: Surface Mount; Case/Package: 0603; Color: Red; Case Code (Metric): 1608; Case Code (Imperial): 0603; Min Operating Temperature: -40°C; Max Operating Temperature: 85°C; Package Quantity: 1; Packaging: Cut Tape; Luminous Intensity: 250mcd; Wavelength: 625nm; Dominant Wavelength: 625nm; Length: 1.6mm; Height: 0.7mm; Width: 0.8mm; REACH SVHC: Unknown; ComponentLink1URL: https://katalog.we-online.de/led/datasheet/150060RS75000.pdf?src-supplier=Digi-Key; ComponentLink1Description: https://katalog.we-online.de/led/datasheet/150060RS75000.pdf?src-supplier=Digi-Key; ComponentLink2URL: http://www.produktinfo.conrad.com/datenblaetter/750000-774999/759428-da-01-en-CHIPLED_0603_W_KL_ROT_150060RS75000.pdf?src-supplier=Conrad; ComponentLink2Description: http://www.produktinfo.conrad.com/datenblaetter/750000-774999/759428-da-01-en-CHIPLED_0603_W_KL_ROT_150060RS75000.pdf?src-supplier=Conrad; Supplier Part Number 1: 710-150060RS75000; Category: Standard LEDs - SMD
LS1 = Buzzers: Audio 1.1Vp-p 3Vp-p 30mA 1.5Vp-p 85dBA 2400Hz to 2800Hz Through Hole Pin Bulk; Manufacturer: Mallory Sonalert; Manufacturer Part Number: PB-1226PEAQ; Shape: Round; Frequency: 2.6kHz; Operating Supply Voltage: 3V; Sensing Method: Magnetic; Washable: No; Supplier 1: Mouser; Stock 1: 5737; Pricing 1: 1=0.83, 10=0.66, 25=0.6, 50=0.561, 100=0.522, 250=0.478, 500=0.445, 1000=0.415, 2500=0.373, 10000=0.373 (USD); Mount: Through Hole; Min Operating Temperature: -30°C; Max Operating Temperature: 70°C; Packaging: Bulk; Package Quantity: 1; Operating Supply Current: 30mA; Termination: PC Pins; Diameter: 12mm; Height: 9.7mm; Depth: 9.5mm; ComponentLink1URL: http://www.mallory-sonalert.com/specifications/PB-1226PEAQ.pdf?src-supplier=Mouser; ComponentLink1Description: http://www.mallory-sonalert.com/specifications/PB-1226PEAQ.pdf?src-supplier=Mouser; ComponentLink2URL: http://www.mallory-sonalert.com/Specifications/PB-1226PEAQ.pdf?src-supplier=Digi-Key; ComponentLink2Description: http://www.mallory-sonalert.com/Specifications/PB-1226PEAQ.pdf?src-supplier=Digi-Key; ComponentLink3URL: https://www.alliedelec.com/m/d/fa962c4a5e81773ad0a24e293c835384.pdf?src-supplier=Allied+Electronics; ComponentLink3Description: https://www.alliedelec.com/m/d/fa962c4a5e81773ad0a24e293c835384.pdf?src-supplier=Allied+Electronics; Supplier Part Number 1: 539-PB1226PEAQ; Category: Piezo Buzzers & Audio Indicators
Q1 = MOSFET: MOSFET N-CH 30V 6.2A SOT23; Manufacturer: Diodes; Manufacturer Part Number: DMN3023L-7; Rds On Max: 25mR; Input Capacitance: 873pF; Max Power Dissipation: 900mW; Supplier 1: Mouser; Stock 1: 65104; Pricing 1: 1=0.35, 10=0.271, 50=0.271, 100=0.147, 1000=0.11, 3000=0.095, 9000=0.089, 10000=0.089 (USD); Mount: Surface Mount; Case/Package: TO-236-3; Min Operating Temperature: -55°C; Max Operating Temperature: 150°C; Packaging: Tape and Reel; Drain to Source Voltage (Vdss): 30V; Continuous Drain Current (ID): 6.2A; ComponentLink1URL: https://www.diodes.com/assets/Datasheets/DMN3023L.pdf?src-supplier=Digi-Key; ComponentLink1Description: https://www.diodes.com/assets/Datasheets/DMN3023L.pdf?src-supplier=Digi-Key; ComponentLink2URL: http://www.farnell.com/datasheets/2814401.pdf?src-supplier=Newark; ComponentLink2Description: http://www.farnell.com/datasheets/2814401.pdf?src-supplier=Newark; ComponentLink3URL: http://www.mouser.com/ds/2/115/DMN3023L-959533.pdf?src-supplier=Mouser; ComponentLink3Description: http://www.mouser.com/ds/2/115/DMN3023L-959533.pdf?src-supplier=Mouser; Supplier Part Number 1: 621-DMN3023L-7; Category: MOSFET
R16 = Resistor 10k 0805: as R12 on sheet C_M; Supplier 1: Mouser; Stock 1: 474662; Pricing 1: 1=0.1, 10=0.066, 50=0.066, 100=0.06, 1000=0.043, 10000=0.019 (USD); Case/Package: 0805; Weight: 0.000194oz; Case Code (Imperial): 0805; Case Code (Metric): 2012; Contact Plating: Tin; Min Operating Temperature: -55°C; Max Operating Temperature: 155°C; Tolerance: 1%; Packaging: Tape and Reel; Package Quantity: 5000; Composition: Thick Film; Military Standard: Not; Termination: SMD/SMT; Voltage Rating (DC): 150V; Length: 2mm; Height: 0.45mm; Width: 1.25mm; Depth: 1.25mm; Radiation Hardening: No; REACH SVHC: Unknown; Lead Free: Lead Free; ComponentLink1URL: http://www.mouser.com/ds/2/427/dcrcwe3-109170.pdf?src-supplier=Mouser; ComponentLink1Description: http://www.mouser.com/ds/2/427/dcrcwe3-109170.pdf?src-supplier=Mouser; ComponentLink2URL: http://uk.rs-online.com/webdocs/0d98/0900766b80d98b26.pdf?src-supplier=RSComponents; ComponentLink2Description: http://uk.rs-online.com/webdocs/0d98/0900766b80d98b26.pdf?src-supplier=RSComponents; ComponentLink3URL: http://www.alliedelec.com/m/d/0c934d6939ccefa68dbe0b96d821c8cf.pdf?src-supplier=Allied+Electronics; ComponentLink3Description: http://www.alliedelec.com/m/d/0c934d6939ccefa68dbe0b96d821c8cf.pdf?src-supplier=Allied+Electronics; ComponentLink4URL: http://www.vishay.com/docs/20035/dcrcwe3.pdf?src-supplier=Avnet+Asia; ComponentLink4Description: http://www.vishay.com/docs/20035/dcrcwe3.pdf?src-supplier=Avnet+Asia; ComponentLink5URL: http://www.vishay.com/docs/20035/dcrcwe3.pdf?src-supplier=Avnet+Europe; ComponentLink5Description: http://www.vishay.com/docs/20035/dcrcwe3.pdf?src-supplier=Avnet+Europe; ComponentLink6URL: http://www.vishay.com/docs/20035/dcrcwe3.pdf?src-supplier=Avnet; ComponentLink6Description: http://www.vishay.com/docs/20035/dcrcwe3.pdf?src-supplier=Avnet; ComponentLink7URL: http://www.farnell.com/datasheets/2310790.pdf?src-supplier=Element14; ComponentLink7Description: http://www.farnell.com/datasheets/2310790.pdf?src-supplier=Element14; ComponentLink8URL: http://www.vishay.com/docs/20035/dcrcwe3.pdf?src-supplier=Future+Electronics; ComponentLink8Description: http://www.vishay.com/docs/20035/dcrcwe3.pdf?src-supplier=Future+Electronics; Supplier Part Number 1: 71-CRCW0805-10K-E3; Category: Thick Film Resistors - SMD
R17 = Resistor 1K 0805: RES SMD 1K OHM 1% 1/8W 0805; Manufacturer: Vishay Dale; Manufacturer Part Number: CRCW08051K00FKEA; Voltage Rating: 150V; Power Rating: 125mW; Resistance: 1kR; Temperature Coefficient: 100ppm/°C; Supplier 1: Mouser; Stock 1: 338031; Pricing 1: 1=0.12, 10=0.06, 50=0.06, 100=0.034, 1000=0.02, 10000=0.01 (USD); Case/Package: 0805; Number of Pins: 2; Weight: 0.000194oz; Case Code (Imperial): 0805; Case Code (Metric): 2012; Contact Plating: Tin; Min Operating Temperature: -55°C; Max Operating Temperature: 155°C; Packaging: Tape and Reel; Package Quantity: 5000; Tolerance: 1%; Composition: Thick Film; Termination: SMD/SMT; Military Standard: Not; Voltage Rating (DC): 150V; Length: 2mm; Height: 0.45mm; Width: 1.25mm; Depth: 1.25mm; Radiation Hardening: No; REACH SVHC: Unknown; Lead Free: Lead Free; ComponentLink1URL: http://uk.rs-online.com/webdocs/0d98/0900766b80d98b26.pdf?src-supplier=RSComponents; ComponentLink1Description: http://uk.rs-online.com/webdocs/0d98/0900766b80d98b26.pdf?src-supplier=RSComponents; ComponentLink2URL: http://www.farnell.com/datasheets/2310790.pdf?src-supplier=Element14; ComponentLink2Description: http://www.farnell.com/datasheets/2310790.pdf?src-supplier=Element14; ComponentLink3URL: http://www.vishay.com/docs/20035/dcrcwe3.pdf?src-supplier=Avnet; ComponentLink3Description: http://www.vishay.com/docs/20035/dcrcwe3.pdf?src-supplier=Avnet; ComponentLink4URL: https://www.distrelec.biz/Web/Downloads/a_/en/flD-CRCW-e3_data_en.pdf?mime=application%2Fpdf&src-supplier=Distrelec; ComponentLink4Description: https://www.distrelec.biz/Web/Downloads/a_/en/flD-CRCW-e3_data_en.pdf?mime=application%2Fpdf&src-supplier=Distrelec; ComponentLink5URL: http://www.vishay.com/docs/20035/dcrcwe3.pdf?src-supplier=Future+Electronics; ComponentLink5Description: http://www.vishay.com/docs/20035/dcrcwe3.pdf?src-supplier=Future+Electronics; ComponentLink6URL: http://www.vishay.com/docs/20035/dcrcwe3.pdf?src-supplier=Avnet+Europe; ComponentLink6Description: http://www.vishay.com/docs/20035/dcrcwe3.pdf?src-supplier=Avnet+Europe; Supplier Part Number 1: 71-CRCW0805-1.0K-E3; Category: Thick Film Resistors - SMD
R18-R21 = Resistor 100 0603: RES SMD 100 OHM 1% 1/10W 0603; Manufacturer: Vishay Intertechnology; Manufacturer Part Number: CRCW0603100RFKEA; Power Rating: 100mW; Voltage Rating (DC): 75V; Temperature Coefficient: 100ppm/°C; Supplier 1: Mouser; Stock 1: 221485; Pricing 1: 1=0.1, 10=0.037, 50=0.037, 100=0.026, 1000=0.006, 10000=0.005 (USD); Case/Package: 0603; Number of Pins: 2; Packaging: Cut Tape; Resistance: 100R; Tolerance: 1%; Length: 1.55mm; Height: 450um; Width: 850um; REACH SVHC: No SVHC; Lead Free: Lead Free; Supplier Part Number 1: 71-CRCW0603-100-E3; Category: Thick Film Resistors - SMD

## Nets that join several sheets
+3.3: Fonte (C4.2 R2.2 U2.2), Gyro (C12.2 C13.1 U14.1 U14.16), C_M (U11.4), Micro (20 pins), Leds (R18.1 R19.1 R20.1 R21.1)
+5: Fonte (C6.2 R3.2 U3.2), Head_Sensors (6 pins), C_M (11 pins), Side (R26.1 R28.1 R37.1 R39.1), Leds (LS1.1)
+5_2: Fonte (C36.2 U21.2), Head_Sensors (8 pins), Side (R25.1 R27.1 R36.1 R38.1)
+6: Fonte (C2.1 R1.2 U1.2), Motor (13 pins)
GND: Fonte (16 pins), Head_Sensors (14 pins), Gyro (7 pins), Motor (13 pins), C_M (15 pins), Micro (23 pins), Side (8 pins), Leds (Q1.2 R16.1)
BLUE_RX: C_M (M3.1), Micro (U15.42)
BLUE_TX: C_M (M3.2), Micro (U15.43)
BUZZER: Micro (U15.40), Leds (R16.2 R17.2)
ENCODER_D_1: Motor (M5.1), Micro (U15.14)
ENCODER_D_2: Motor (M5.2), Micro (U15.15)
ENCODER_E_1: Motor (M7.1), Micro (U15.57)
ENCODER_E_2: Motor (M7.2), Micro (U15.56)
GYRO_I/O: Gyro (U14.5), Micro (U15.50)
GYRO_MISO: Gyro (U14.3), Micro (U15.52)
GYRO_MOSI: Gyro (U14.4), Micro (U15.53)
GYRO_SCK: Gyro (U14.2), Micro (U15.51)
LED_TEST_1: Micro (U15.10), Leds (D6.1)
LED_TEST_2: Micro (U15.11), Leds (D7.1)
LED_TEST_3: Micro (U15.9), Leds (D8.1)
LED_TEST_4: Micro (U15.8), Leds (D9.1)
MEMO_I/O: C_M (R11.1 U12.1), Micro (U15.33)
MEMO_MISO: C_M (R15.1 U12.5), Micro (U15.35)
MEMO_MOSI: C_M (R14.1 U12.2), Micro (U15.36)
MEMO_SCK: C_M (U12.6), Micro (U15.34)
SENSOR_0: Head_Sensors (R31.2 U6.3), Micro (U15.26)
SENSOR_1: Head_Sensors (R30.2 U5.3), Micro (U15.25)
SENSOR_2: Head_Sensors (R29.2 U4.3), Micro (U15.24)
SENSOR_3: Head_Sensors (R33.2 U7.3), Micro (U15.23)
SENSOR_4: Head_Sensors (R35.2 U10.3), Micro (U15.22)
SENSOR_5: Head_Sensors (R34.2 U9.3), Micro (U15.21)
SENSOR_6: Head_Sensors (R32.2 U8.3), Micro (U15.20)
SENSOR_DIR: Micro (U15.17), Side (R36.2 R38.2 U17.3 U19.3)
SENSOR_ESQ: Micro (U15.27), Side (R37.2 R39.2 U18.3 U20.3)
TB66_ADC_1: Motor (U16.21), Micro (U15.4)
TB66_ADC_2: Motor (U16.22), Micro (U15.5)
TB66_ADC_3: Motor (U16.17), Micro (U15.3)
TB66_ADC_4: Motor (U16.16), Micro (U15.2)
TB66_PWM_1: Motor (U16.15), Micro (U15.62)
TB66_PWM_2: Motor (U16.23), Micro (U15.61)
USB_RX: C_M (U11.5), Micro (U15.37)
USB_TX: C_M (U11.1), Micro (U15.38)